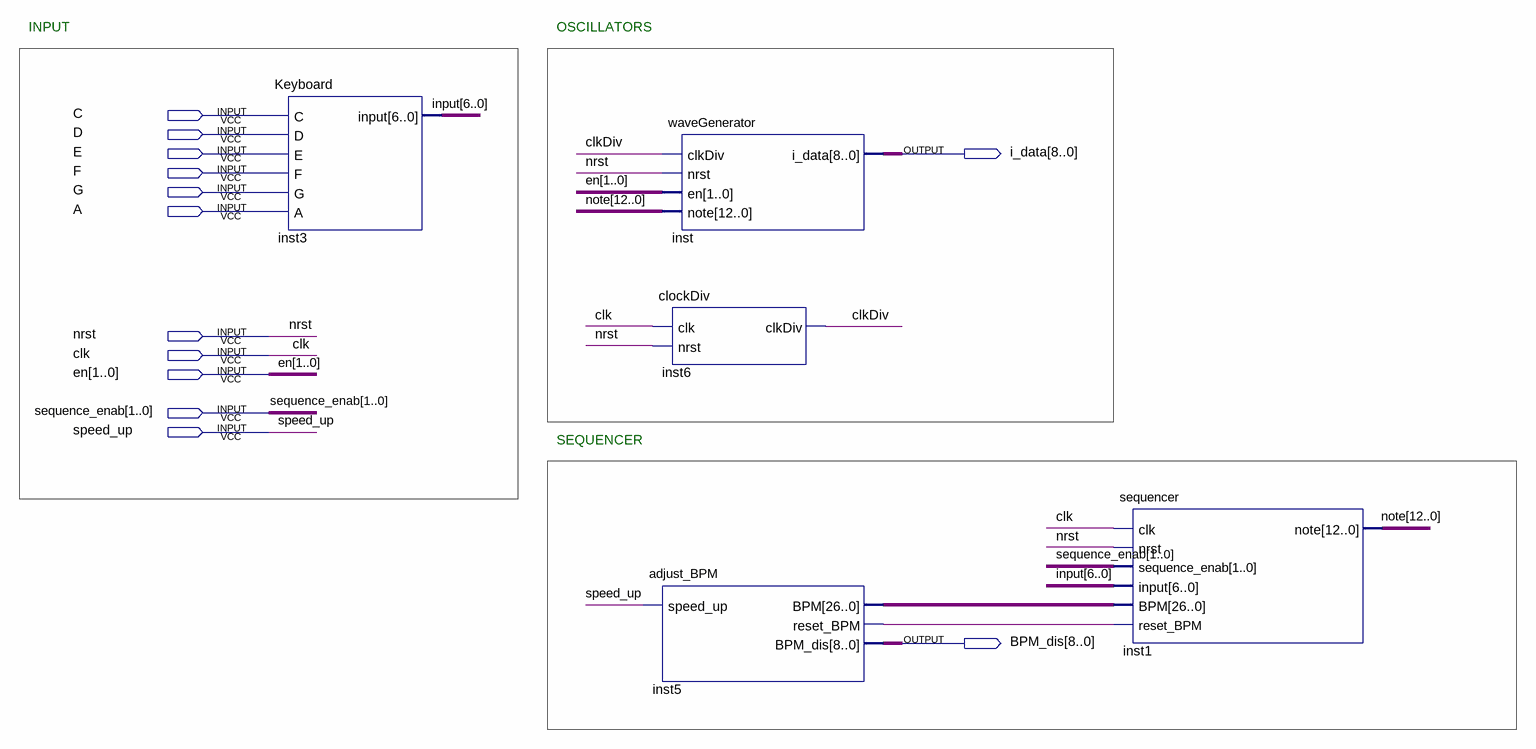
[diagram p0: schematic sheet]
// Quartus schematic Monothonic_synth.bdf as structural Verilog: 5 symbols, 13 pins
module Monothonic_synth (
  input  C,
  input  D,
  input  E,
  input  F,
  input  G,
  input  A,
  input  nrst,
  input  clk,
  input  [1:0] en,
  input  [1:0] sequence_enab,
  input  speed_up,
  output [8:0] i_data,
  output [8:0] BPM_dis
);

  wire clkDiv, inst5_reset_bpm;
  wire [6:0] \input ;
  wire [12:0] note;
  wire [26:0] inst5_bpm;

  Keyboard inst3 (.C(C), .D(D), .E(E), .F(F), .G(G), .A(A), .\input (\input ));
  adjust_BPM inst5 (.speed_up(speed_up), .BPM(inst5_bpm), .reset_BPM(inst5_reset_bpm), .BPM_dis(BPM_dis));
  waveGenerator inst (.clkDiv(clkDiv), .nrst(nrst), .en(en), .note(note), .i_data(i_data));
  clockDiv inst6 (.clk(clk), .nrst(nrst), .clkDiv(clkDiv));
  sequencer inst1 (
    .clk(clk), .nrst(nrst), .sequence_enab(sequence_enab), .\input (\input ), .BPM(inst5_bpm),
    .reset_BPM(inst5_reset_bpm), .note(note));

  // Notes on the sheet:
  //   INPUT
  //   OSCILLATORS
  //   SEQUENCER
endmodule
